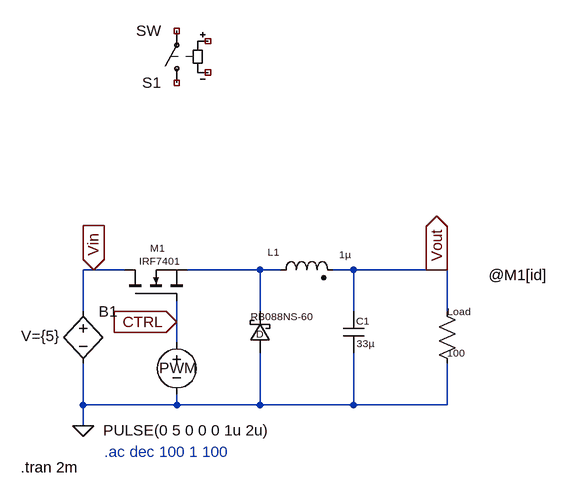
[diagram p0: schematic Switch Model.asc]
Switch Model.asc, the LTspice schematic file:
Version 4
SHEET 1 2460 680
WIRE 1264 -224 1248 -224
WIRE 1312 -224 1264 -224
WIRE 1520 -224 1408 -224
WIRE 1552 -224 1520 -224
WIRE 1664 -224 1632 -224
WIRE 1792 -224 1664 -224
WIRE 1808 -224 1792 -224
WIRE 1248 -160 1248 -224
WIRE 1520 -160 1520 -224
WIRE 1664 -160 1664 -224
WIRE 1808 -160 1808 -224
WIRE 1392 -144 1392 -176
WIRE 1392 -112 1392 -144
WIRE 1248 -16 1248 -80
WIRE 1392 -16 1392 -32
WIRE 1392 -16 1248 -16
WIRE 1520 -16 1520 -96
WIRE 1520 -16 1392 -16
WIRE 1664 -16 1664 -96
WIRE 1664 -16 1520 -16
WIRE 1808 -16 1808 -80
WIRE 1808 -16 1664 -16
WIRE 1248 16 1248 -16
FLAG 1792 -224 Vout
IOPIN 1792 -224 Out
FLAG 1248 16 0
FLAG 1264 -224 Vin
IOPIN 1264 -224 In
FLAG 1392 -144 CTRL
IOPIN 1392 -144 In
SYMBOL schottky 1536 -96 R180
WINDOW 0 10 29 Left 1
WINDOW 3 -64 56 Left 1
SYMATTR InstName D
SYMATTR Value RB088NS-60
SYMATTR Description Diode
SYMATTR Type diode
SYMBOL res 1824 -64 R180
WINDOW 0 -20 96 Left 1
WINDOW 3 -11 32 Left 1
SYMATTR InstName Load
SYMATTR Value 100
SYMBOL cap 1648 -160 R0
WINDOW 0 20 15 Left 1
WINDOW 3 21 49 Left 1
SYMATTR InstName C1
SYMATTR Value 33µ
SYMBOL ind2 1536 -208 R270
WINDOW 0 33 5 VTop 1
WINDOW 3 50 115 VBottom 1
SYMATTR InstName L1
SYMATTR Value 1µ
SYMATTR SpiceLine Ipk=17 Rser=0.0052 Rpar=2269 Cpar=4.744p
SYMATTR Type ind
SYMBOL nmos 1312 -176 R270
WINDOW 0 82 39 VRight 1
WINDOW 3 62 22 VRight 1
SYMATTR InstName M1
SYMATTR Value IRF7401
SYMBOL voltage 1392 -128 R0
WINDOW 0 -27 55 Left 2
WINDOW 123 0 0 Left 0
WINDOW 39 0 0 Left 0
WINDOW 3 -113 151 Left 2
SYMATTR InstName PWM
SYMATTR Value PULSE(0 5 0 0 0 1u 2u)
SYMBOL bv 1248 -176 R0
WINDOW 3 -95 54 Left 2
SYMATTR Value V={5}
SYMATTR InstName B1
SYMBOL sw 1392 -496 R180
SYMATTR InstName S1
TEXT 1280 56 Left 2 ;.ac dec 100 1 100
TEXT 1152 80 Left 2 !.tran 2m
TEXT 1872 -216 Left 2 !@M1[id]

The netlist it stands for:
* Switch Model.asc
D 0 N001 RB088NS-60
R§Load 0 Vout 100
C1 Vout 0 33µ
L1 N001 Vout 1µ Ipk=17 Rser=0.0052 Rpar=2269 Cpar=4.744p
M1 Vin CTRL N001 N001 IRF7401
V§PWM CTRL 0 PULSE(0 5 0 0 0 1u 2u)
B1 Vin 0 V={5}
S1 NC_01 NC_02 NC_03 NC_04 SW
.model D D
.lib standard.dio
.model NMOS NMOS
.model PMOS PMOS
.lib standard.mos
* .ac dec 100 1 100
.tran 2m
@M1[id]
.backanno
.end